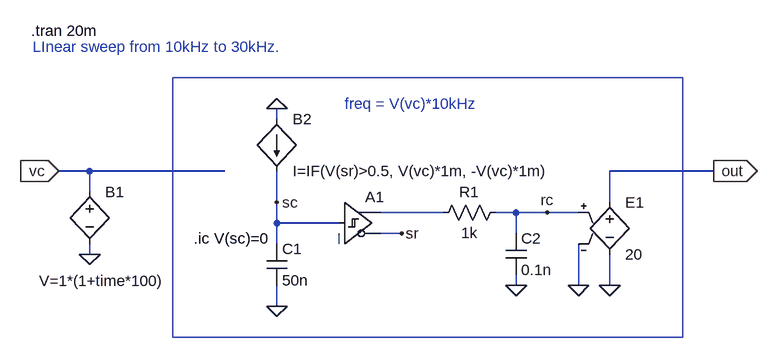
[diagram p0: schematic sweep_squarewave.asc]
sweep_squarewave.asc, the LTspice schematic file:
Version 4
SHEET 1 1064 680
WIRE 288 16 288 0
WIRE 0 96 -48 96
WIRE 208 96 0 96
WIRE 960 96 800 96
WIRE 0 128 0 96
WIRE 288 144 288 96
WIRE 800 144 800 96
WIRE 544 160 448 160
WIRE 656 160 624 160
WIRE 704 160 656 160
WIRE 752 160 704 160
WIRE 288 176 288 144
WIRE 384 176 288 176
WIRE 480 192 448 192
WIRE 656 192 656 160
WIRE 288 208 288 176
WIRE 0 224 0 208
WIRE 656 272 656 256
WIRE 752 272 752 208
WIRE 800 272 800 224
WIRE 288 304 288 272
FLAG 0 224 0
FLAG -48 96 vc
IOPIN -48 96 In
FLAG 288 304 0
FLAG 288 0 0
FLAG 480 192 sr
FLAG 288 144 sc
FLAG 656 272 0
FLAG 752 272 0
FLAG 800 272 0
FLAG 960 96 out
IOPIN 960 96 Out
FLAG 704 160 rc
SYMBOL bv 0 112 R0
WINDOW 3 -78 153 Left 2
SYMATTR InstName B1
SYMATTR Value V=1*(1+time*100)
SYMBOL Digital\\schmitt 384 112 R0
SYMATTR InstName A1
SYMATTR SpiceLine Vt=0.5 vh=0.5
SYMBOL bi 288 16 R0
SYMATTR InstName B2
SYMATTR Value I=IF(V(sr)>0.5, V(vc)*1m, -V(vc)*1m)
SYMBOL cap 272 208 R0
SYMATTR InstName C1
SYMATTR Value 50n
SYMBOL res 528 176 R270
WINDOW 0 32 56 VTop 2
WINDOW 3 0 56 VBottom 2
SYMATTR InstName R1
SYMATTR Value 1k
SYMBOL cap 640 192 R0
SYMATTR InstName C2
SYMATTR Value 0.1n
SYMBOL e 800 128 R0
SYMATTR InstName E1
SYMATTR Value 20
TEXT -90 -120 Left 2 !.tran 20m
TEXT 160 200 Left 2 !.ic V(sc)=0
TEXT 392 -8 Left 2 ;freq = V(vc)*10kHz
TEXT -88 -96 Left 2 ;LInear sweep from 10kHz to 30kHz.
RECTANGLE Normal 912 352 128 -48

The netlist it stands for:
* sweep_squarewave.asc
B1 vc 0 V=1*(1+time*100)
A1 sc 0 0 0 0 sr N001 0 SCHMITT Vt=0.5 vh=0.5
B2 0 sc I=IF(V(sr)>0.5, V(vc)*1m, -V(vc)*1m)
C1 sc 0 50n
R1 N001 rc 1k
C2 rc 0 0.1n
E1 out 0 rc 0 20
.tran 20m
.ic V(sc)=0
* freq = V(vc)*10kHz
* LInear sweep from 10kHz to 30kHz.
.backanno
.end